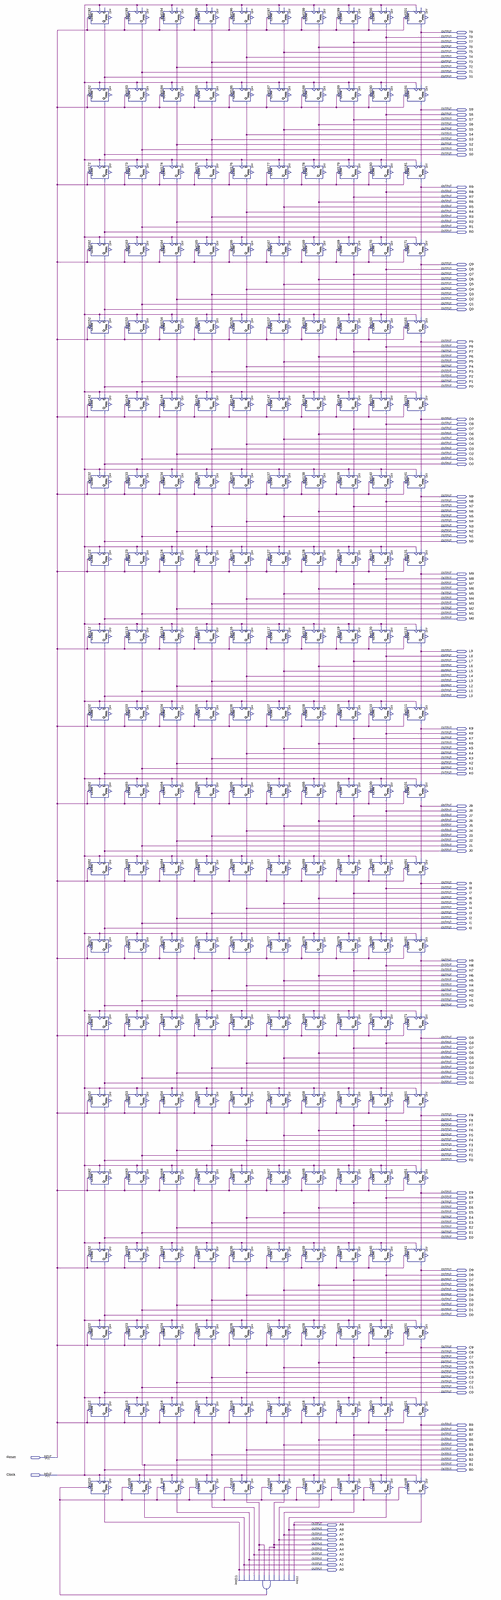
[diagram p0: schematic sheet, whole]
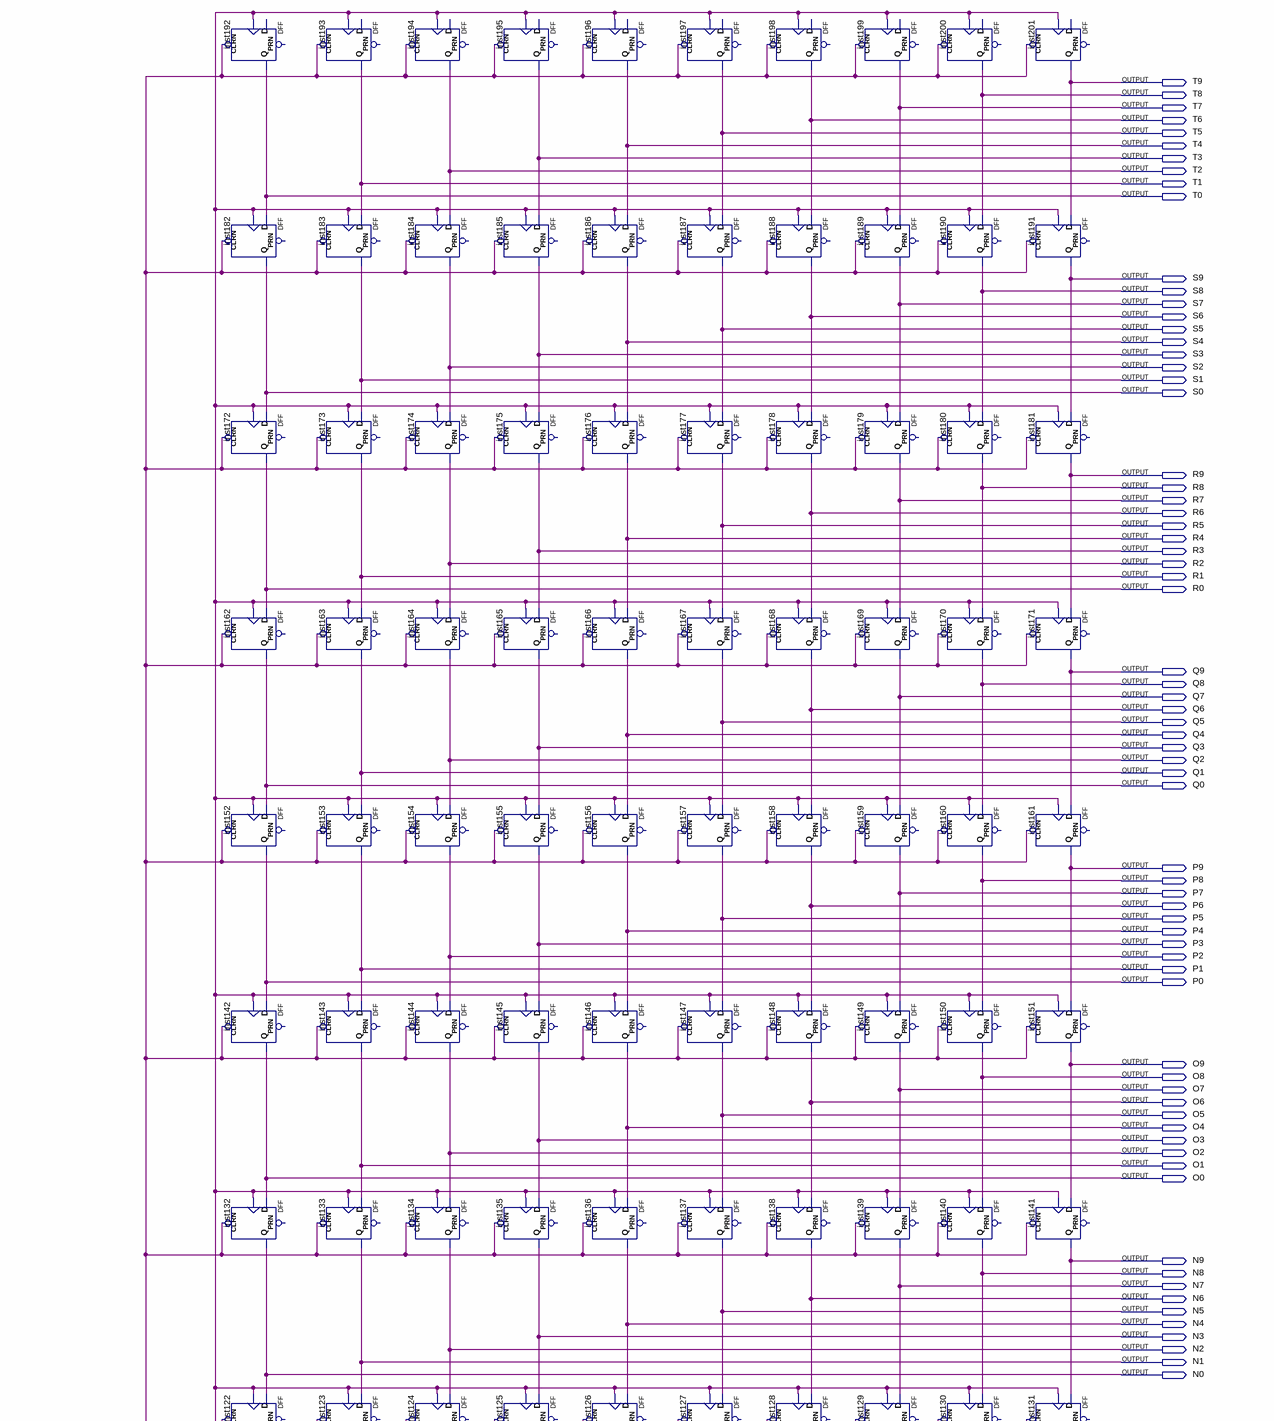
[diagram p1: schematic sheet, upper part]
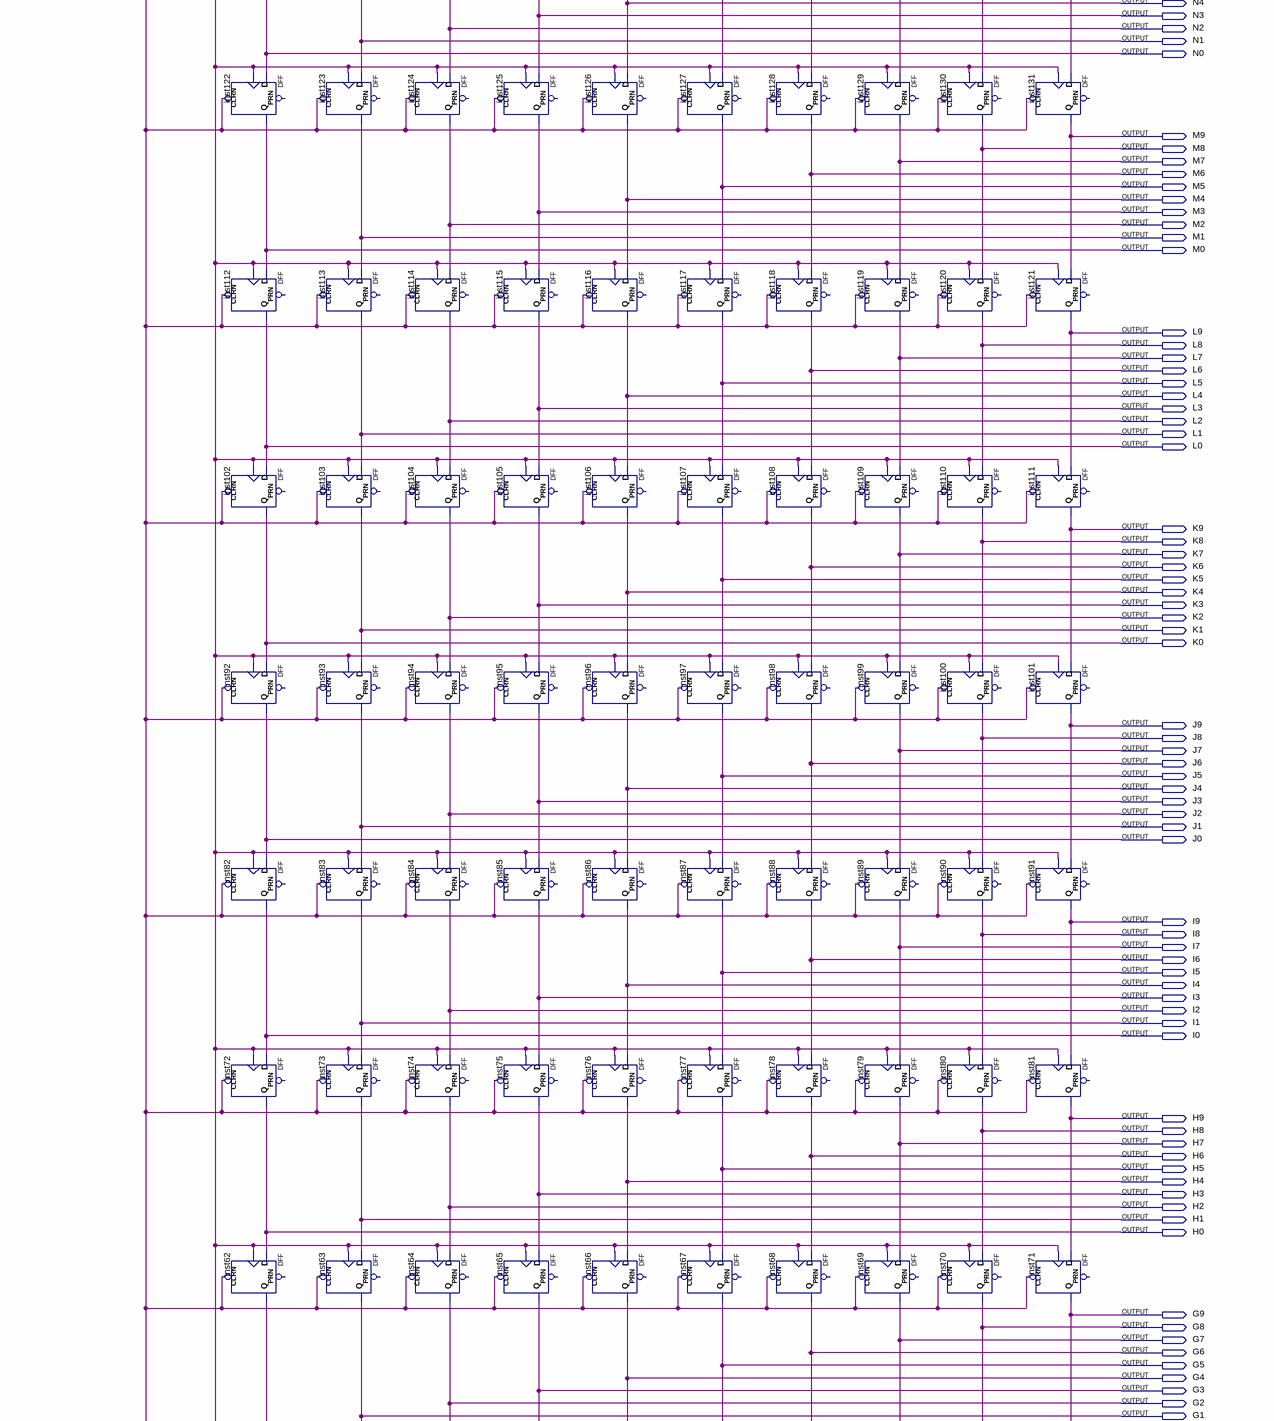
[diagram p2: schematic sheet, middle part]
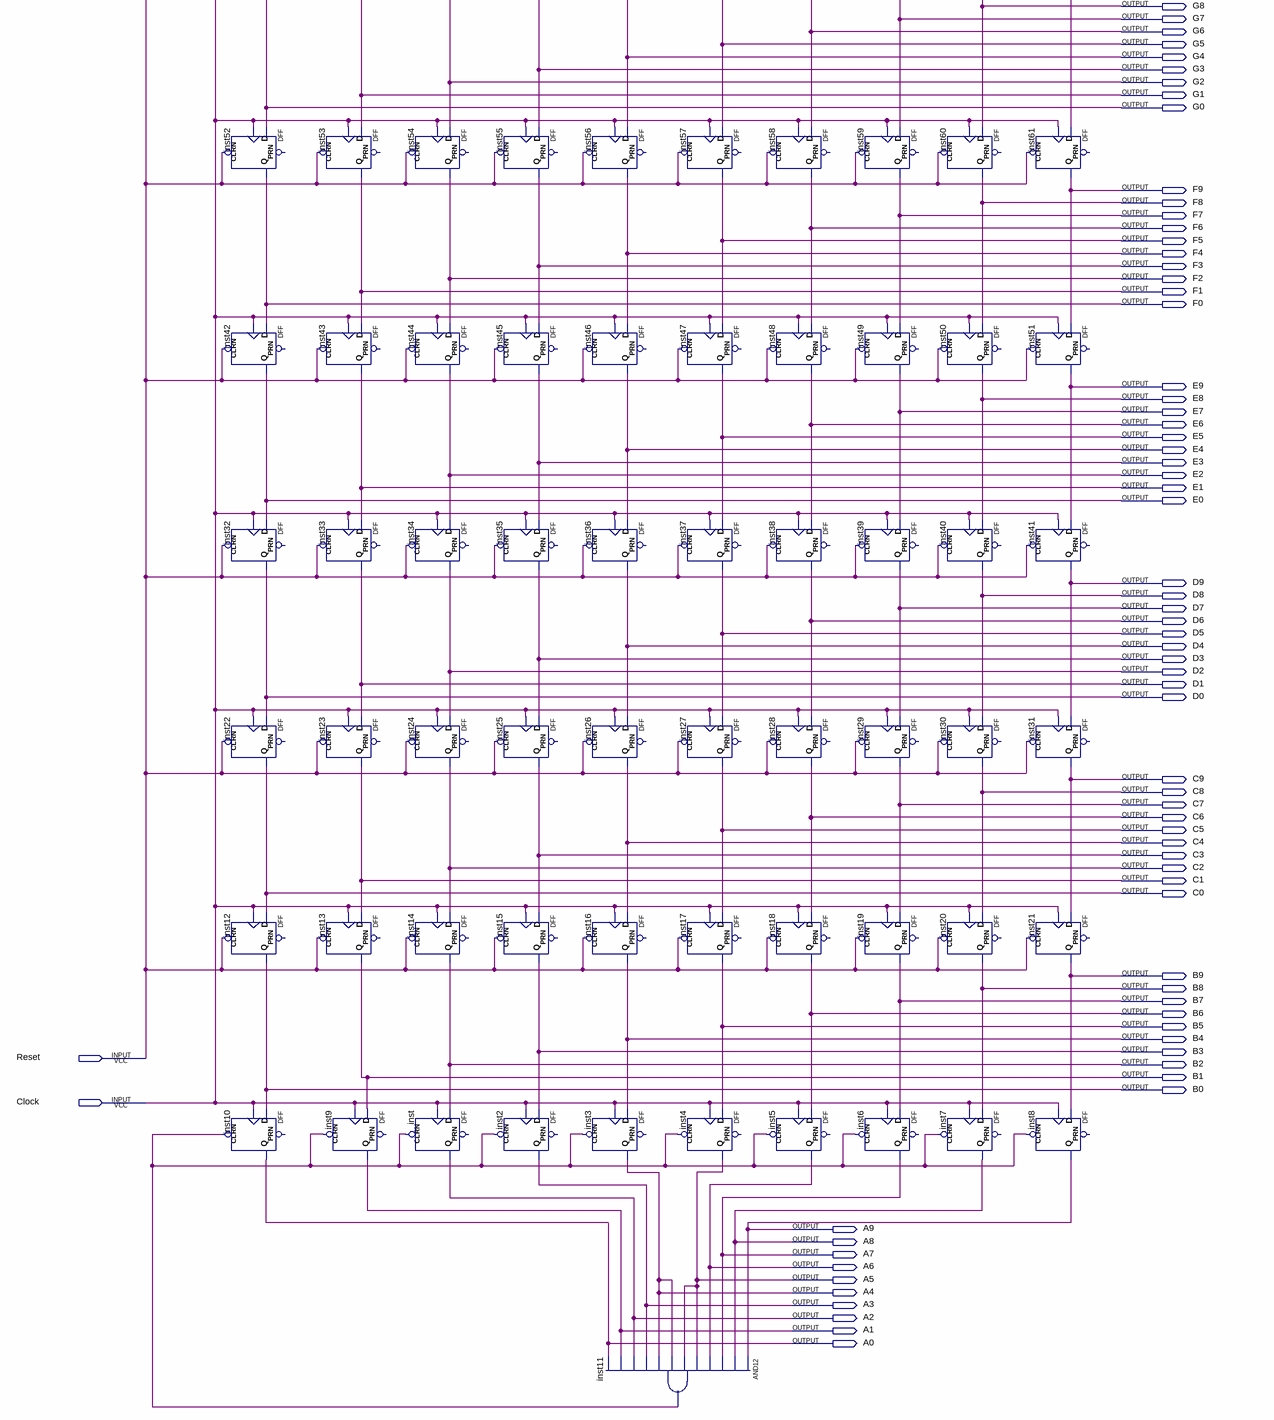
[diagram p3: schematic sheet, lower part]
// Quartus schematic SmallGameBoard.bdf as structural Verilog: 201 symbols, 202 pins
module SmallGameBoard (
  input  Reset,
  input  Clock,
  output T9,
  output T8,
  output T7,
  output T6,
  output T5,
  output T4,
  output T3,
  output T2,
  output T1,
  output T0,
  output S9,
  output S8,
  output S7,
  output S6,
  output S5,
  output S4,
  output S3,
  output S2,
  output S1,
  output S0,
  output R9,
  output R8,
  output R7,
  output R6,
  output R5,
  output R4,
  output R3,
  output R2,
  output R1,
  output R0,
  output Q9,
  output Q8,
  output Q7,
  output Q6,
  output Q5,
  output Q4,
  output Q3,
  output Q2,
  output Q1,
  output Q0,
  output P9,
  output P8,
  output P7,
  output P6,
  output P5,
  output P4,
  output P3,
  output P2,
  output P1,
  output P0,
  output O9,
  output O8,
  output O7,
  output O6,
  output O5,
  output O4,
  output O3,
  output O2,
  output O1,
  output O0,
  output N9,
  output N8,
  output N7,
  output N6,
  output N5,
  output N4,
  output N3,
  output N2,
  output N1,
  output N0,
  output M9,
  output M8,
  output M7,
  output M6,
  output M5,
  output M4,
  output M3,
  output M2,
  output M1,
  output M0,
  output L9,
  output L8,
  output L7,
  output L6,
  output L5,
  output L4,
  output L3,
  output L2,
  output L1,
  output L0,
  output K9,
  output K8,
  output K7,
  output K6,
  output K5,
  output K4,
  output K3,
  output K2,
  output K1,
  output K0,
  output J9,
  output J8,
  output J7,
  output J6,
  output J5,
  output J4,
  output J3,
  output J2,
  output J1,
  output J0,
  output I9,
  output I8,
  output I7,
  output I6,
  output I5,
  output I4,
  output I3,
  output I2,
  output I1,
  output I0,
  output H9,
  output H8,
  output H7,
  output H6,
  output H5,
  output H4,
  output H3,
  output H2,
  output H1,
  output H0,
  output G9,
  output G8,
  output G7,
  output G6,
  output G5,
  output G4,
  output G3,
  output G2,
  output G1,
  output G0,
  output F9,
  output F8,
  output F7,
  output F6,
  output F5,
  output F4,
  output F3,
  output F2,
  output F1,
  output F0,
  output E9,
  output E8,
  output E7,
  output E6,
  output E5,
  output E4,
  output E3,
  output E2,
  output E1,
  output E0,
  output D9,
  output D8,
  output D7,
  output D6,
  output D5,
  output D4,
  output D3,
  output D2,
  output D1,
  output D0,
  output C9,
  output C8,
  output C7,
  output C6,
  output C5,
  output C4,
  output C3,
  output C2,
  output C1,
  output C0,
  output B9,
  output B8,
  output B7,
  output B6,
  output B5,
  output B4,
  output B3,
  output B2,
  output B1,
  output B0,
  output A9,
  output A8,
  output A7,
  output A6,
  output A5,
  output A4,
  output A3,
  output A2,
  output A1,
  output A0
);

  wire inst11_out;

  DFF inst192 (.CLRN(Reset), .CLK(Clock), .Q(T0));  // open: D, PRN
  DFF inst182 (.CLRN(Reset), .CLK(Clock), .D(T0), .Q(S0));  // open: PRN
  DFF inst172 (.CLRN(Reset), .CLK(Clock), .D(S0), .Q(R0));  // open: PRN
  DFF inst162 (.CLRN(Reset), .CLK(Clock), .D(R0), .Q(Q0));  // open: PRN
  DFF inst152 (.CLRN(Reset), .CLK(Clock), .D(Q0), .Q(P0));  // open: PRN
  DFF inst142 (.CLRN(Reset), .CLK(Clock), .D(P0), .Q(O0));  // open: PRN
  DFF inst132 (.CLRN(Reset), .CLK(Clock), .D(O0), .Q(N0));  // open: PRN
  DFF inst122 (.CLRN(Reset), .CLK(Clock), .D(N0), .Q(M0));  // open: PRN
  DFF inst112 (.CLRN(Reset), .CLK(Clock), .D(M0), .Q(L0));  // open: PRN
  DFF inst102 (.CLRN(Reset), .CLK(Clock), .D(L0), .Q(K0));  // open: PRN
  DFF inst92 (.CLRN(Reset), .CLK(Clock), .D(K0), .Q(J0));  // open: PRN
  DFF inst82 (.CLRN(Reset), .CLK(Clock), .D(J0), .Q(I0));  // open: PRN
  DFF inst72 (.CLRN(Reset), .CLK(Clock), .D(I0), .Q(H0));  // open: PRN
  DFF inst62 (.CLRN(Reset), .CLK(Clock), .D(H0), .Q(G0));  // open: PRN
  DFF inst52 (.CLRN(Reset), .CLK(Clock), .D(G0), .Q(F0));  // open: PRN
  DFF inst42 (.CLRN(Reset), .CLK(Clock), .D(F0), .Q(E0));  // open: PRN
  DFF inst32 (.CLRN(Reset), .CLK(Clock), .D(E0), .Q(D0));  // open: PRN
  DFF inst22 (.CLRN(Reset), .CLK(Clock), .D(D0), .Q(C0));  // open: PRN
  DFF inst12 (.CLRN(Reset), .CLK(Clock), .D(C0), .Q(B0));  // open: PRN
  DFF inst10 (.CLRN(inst11_out), .CLK(Clock), .D(B0), .Q(A0));  // open: PRN
  DFF inst193 (.CLRN(Reset), .CLK(Clock), .Q(T1));  // open: D, PRN
  DFF inst183 (.CLRN(Reset), .CLK(Clock), .D(T1), .Q(S1));  // open: PRN
  DFF inst173 (.CLRN(Reset), .CLK(Clock), .D(S1), .Q(R1));  // open: PRN
  DFF inst163 (.CLRN(Reset), .CLK(Clock), .D(R1), .Q(Q1));  // open: PRN
  DFF inst153 (.CLRN(Reset), .CLK(Clock), .D(Q1), .Q(P1));  // open: PRN
  DFF inst143 (.CLRN(Reset), .CLK(Clock), .D(P1), .Q(O1));  // open: PRN
  DFF inst133 (.CLRN(Reset), .CLK(Clock), .D(O1), .Q(N1));  // open: PRN
  DFF inst123 (.CLRN(Reset), .CLK(Clock), .D(N1), .Q(M1));  // open: PRN
  DFF inst113 (.CLRN(Reset), .CLK(Clock), .D(M1), .Q(L1));  // open: PRN
  DFF inst103 (.CLRN(Reset), .CLK(Clock), .D(L1), .Q(K1));  // open: PRN
  DFF inst93 (.CLRN(Reset), .CLK(Clock), .D(K1), .Q(J1));  // open: PRN
  DFF inst83 (.CLRN(Reset), .CLK(Clock), .D(J1), .Q(I1));  // open: PRN
  DFF inst73 (.CLRN(Reset), .CLK(Clock), .D(I1), .Q(H1));  // open: PRN
  DFF inst63 (.CLRN(Reset), .CLK(Clock), .D(H1), .Q(G1));  // open: PRN
  DFF inst53 (.CLRN(Reset), .CLK(Clock), .D(G1), .Q(F1));  // open: PRN
  DFF inst43 (.CLRN(Reset), .CLK(Clock), .D(F1), .Q(E1));  // open: PRN
  DFF inst33 (.CLRN(Reset), .CLK(Clock), .D(E1), .Q(D1));  // open: PRN
  DFF inst23 (.CLRN(Reset), .CLK(Clock), .D(D1), .Q(C1));  // open: PRN
  DFF inst13 (.CLRN(Reset), .CLK(Clock), .D(C1), .Q(B1));  // open: PRN
  DFF inst9 (.CLRN(inst11_out), .CLK(Clock), .D(B1), .Q(A1));  // open: PRN
  DFF inst194 (.CLRN(Reset), .CLK(Clock), .Q(T2));  // open: D, PRN
  DFF inst184 (.CLRN(Reset), .CLK(Clock), .D(T2), .Q(S2));  // open: PRN
  DFF inst174 (.CLRN(Reset), .CLK(Clock), .D(S2), .Q(R2));  // open: PRN
  DFF inst164 (.CLRN(Reset), .CLK(Clock), .D(R2), .Q(Q2));  // open: PRN
  DFF inst154 (.CLRN(Reset), .CLK(Clock), .D(Q2), .Q(P2));  // open: PRN
  DFF inst144 (.CLRN(Reset), .CLK(Clock), .D(P2), .Q(O2));  // open: PRN
  DFF inst134 (.CLRN(Reset), .CLK(Clock), .D(O2), .Q(N2));  // open: PRN
  DFF inst124 (.CLRN(Reset), .CLK(Clock), .D(N2), .Q(M2));  // open: PRN
  DFF inst114 (.CLRN(Reset), .CLK(Clock), .D(M2), .Q(L2));  // open: PRN
  DFF inst104 (.CLRN(Reset), .CLK(Clock), .D(L2), .Q(K2));  // open: PRN
  DFF inst94 (.CLRN(Reset), .CLK(Clock), .D(K2), .Q(J2));  // open: PRN
  DFF inst84 (.CLRN(Reset), .CLK(Clock), .D(J2), .Q(I2));  // open: PRN
  DFF inst74 (.CLRN(Reset), .CLK(Clock), .D(I2), .Q(H2));  // open: PRN
  DFF inst64 (.CLRN(Reset), .CLK(Clock), .D(H2), .Q(G2));  // open: PRN
  DFF inst54 (.CLRN(Reset), .CLK(Clock), .D(G2), .Q(F2));  // open: PRN
  DFF inst44 (.CLRN(Reset), .CLK(Clock), .D(F2), .Q(E2));  // open: PRN
  DFF inst34 (.CLRN(Reset), .CLK(Clock), .D(E2), .Q(D2));  // open: PRN
  DFF inst24 (.CLRN(Reset), .CLK(Clock), .D(D2), .Q(C2));  // open: PRN
  DFF inst14 (.CLRN(Reset), .CLK(Clock), .D(C2), .Q(B2));  // open: PRN
  DFF inst (.CLRN(inst11_out), .CLK(Clock), .D(B2), .Q(A2));  // open: PRN
  DFF inst195 (.CLRN(Reset), .CLK(Clock), .Q(T3));  // open: D, PRN
  DFF inst185 (.CLRN(Reset), .CLK(Clock), .D(T3), .Q(S3));  // open: PRN
  DFF inst175 (.CLRN(Reset), .CLK(Clock), .D(S3), .Q(R3));  // open: PRN
  DFF inst165 (.CLRN(Reset), .CLK(Clock), .D(R3), .Q(Q3));  // open: PRN
  DFF inst155 (.CLRN(Reset), .CLK(Clock), .D(Q3), .Q(P3));  // open: PRN
  DFF inst145 (.CLRN(Reset), .CLK(Clock), .D(P3), .Q(O3));  // open: PRN
  DFF inst135 (.CLRN(Reset), .CLK(Clock), .D(O3), .Q(N3));  // open: PRN
  DFF inst125 (.CLRN(Reset), .CLK(Clock), .D(N3), .Q(M3));  // open: PRN
  DFF inst115 (.CLRN(Reset), .CLK(Clock), .D(M3), .Q(L3));  // open: PRN
  DFF inst105 (.CLRN(Reset), .CLK(Clock), .D(L3), .Q(K3));  // open: PRN
  DFF inst95 (.CLRN(Reset), .CLK(Clock), .D(K3), .Q(J3));  // open: PRN
  DFF inst85 (.CLRN(Reset), .CLK(Clock), .D(J3), .Q(I3));  // open: PRN
  DFF inst75 (.CLRN(Reset), .CLK(Clock), .D(I3), .Q(H3));  // open: PRN
  DFF inst65 (.CLRN(Reset), .CLK(Clock), .D(H3), .Q(G3));  // open: PRN
  DFF inst55 (.CLRN(Reset), .CLK(Clock), .D(G3), .Q(F3));  // open: PRN
  DFF inst45 (.CLRN(Reset), .CLK(Clock), .D(F3), .Q(E3));  // open: PRN
  DFF inst35 (.CLRN(Reset), .CLK(Clock), .D(E3), .Q(D3));  // open: PRN
  DFF inst25 (.CLRN(Reset), .CLK(Clock), .D(D3), .Q(C3));  // open: PRN
  DFF inst15 (.CLRN(Reset), .CLK(Clock), .D(C3), .Q(B3));  // open: PRN
  DFF inst2 (.CLRN(inst11_out), .CLK(Clock), .D(B3), .Q(A3));  // open: PRN
  DFF inst196 (.CLRN(Reset), .CLK(Clock), .Q(T4));  // open: D, PRN
  DFF inst186 (.CLRN(Reset), .CLK(Clock), .D(T4), .Q(S4));  // open: PRN
  DFF inst176 (.CLRN(Reset), .CLK(Clock), .D(S4), .Q(R4));  // open: PRN
  DFF inst166 (.CLRN(Reset), .CLK(Clock), .D(R4), .Q(Q4));  // open: PRN
  DFF inst156 (.CLRN(Reset), .CLK(Clock), .D(Q4), .Q(P4));  // open: PRN
  DFF inst146 (.CLRN(Reset), .CLK(Clock), .D(P4), .Q(O4));  // open: PRN
  DFF inst136 (.CLRN(Reset), .CLK(Clock), .D(O4), .Q(N4));  // open: PRN
  DFF inst126 (.CLRN(Reset), .CLK(Clock), .D(N4), .Q(M4));  // open: PRN
  DFF inst116 (.CLRN(Reset), .CLK(Clock), .D(M4), .Q(L4));  // open: PRN
  DFF inst106 (.CLRN(Reset), .CLK(Clock), .D(L4), .Q(K4));  // open: PRN
  DFF inst96 (.CLRN(Reset), .CLK(Clock), .D(K4), .Q(J4));  // open: PRN
  DFF inst86 (.CLRN(Reset), .CLK(Clock), .D(J4), .Q(I4));  // open: PRN
  DFF inst76 (.CLRN(Reset), .CLK(Clock), .D(I4), .Q(H4));  // open: PRN
  DFF inst66 (.CLRN(Reset), .CLK(Clock), .D(H4), .Q(G4));  // open: PRN
  DFF inst56 (.CLRN(Reset), .CLK(Clock), .D(G4), .Q(F4));  // open: PRN
  DFF inst46 (.CLRN(Reset), .CLK(Clock), .D(F4), .Q(E4));  // open: PRN
  DFF inst36 (.CLRN(Reset), .CLK(Clock), .D(E4), .Q(D4));  // open: PRN
  DFF inst26 (.CLRN(Reset), .CLK(Clock), .D(D4), .Q(C4));  // open: PRN
  DFF inst16 (.CLRN(Reset), .CLK(Clock), .D(C4), .Q(B4));  // open: PRN
  DFF inst3 (.CLRN(inst11_out), .CLK(Clock), .D(B4), .Q(A4));  // open: PRN
  and inst11 (inst11_out, A9, A8, A7, A6, A5, A5, A4, A4, A3, A2, A1, A0);
  DFF inst197 (.CLRN(Reset), .CLK(Clock), .Q(T5));  // open: D, PRN
  DFF inst187 (.CLRN(Reset), .CLK(Clock), .D(T5), .Q(S5));  // open: PRN
  DFF inst177 (.CLRN(Reset), .CLK(Clock), .D(S5), .Q(R5));  // open: PRN
  DFF inst167 (.CLRN(Reset), .CLK(Clock), .D(R5), .Q(Q5));  // open: PRN
  DFF inst157 (.CLRN(Reset), .CLK(Clock), .D(Q5), .Q(P5));  // open: PRN
  DFF inst147 (.CLRN(Reset), .CLK(Clock), .D(P5), .Q(O5));  // open: PRN
  DFF inst137 (.CLRN(Reset), .CLK(Clock), .D(O5), .Q(N5));  // open: PRN
  DFF inst127 (.CLRN(Reset), .CLK(Clock), .D(N5), .Q(M5));  // open: PRN
  DFF inst117 (.CLRN(Reset), .CLK(Clock), .D(M5), .Q(L5));  // open: PRN
  DFF inst107 (.CLRN(Reset), .CLK(Clock), .D(L5), .Q(K5));  // open: PRN
  DFF inst97 (.CLRN(Reset), .CLK(Clock), .D(K5), .Q(J5));  // open: PRN
  DFF inst87 (.CLRN(Reset), .CLK(Clock), .D(J5), .Q(I5));  // open: PRN
  DFF inst77 (.CLRN(Reset), .CLK(Clock), .D(I5), .Q(H5));  // open: PRN
  DFF inst67 (.CLRN(Reset), .CLK(Clock), .D(H5), .Q(G5));  // open: PRN
  DFF inst57 (.CLRN(Reset), .CLK(Clock), .D(G5), .Q(F5));  // open: PRN
  DFF inst47 (.CLRN(Reset), .CLK(Clock), .D(F5), .Q(E5));  // open: PRN
  DFF inst37 (.CLRN(Reset), .CLK(Clock), .D(E5), .Q(D5));  // open: PRN
  DFF inst27 (.CLRN(Reset), .CLK(Clock), .D(D5), .Q(C5));  // open: PRN
  DFF inst17 (.CLRN(Reset), .CLK(Clock), .D(C5), .Q(B5));  // open: PRN
  DFF inst4 (.CLRN(inst11_out), .CLK(Clock), .D(B5), .Q(A5));  // open: PRN
  DFF inst198 (.CLRN(Reset), .CLK(Clock), .Q(T6));  // open: D, PRN
  DFF inst188 (.CLRN(Reset), .CLK(Clock), .D(T6), .Q(S6));  // open: PRN
  DFF inst178 (.CLRN(Reset), .CLK(Clock), .D(S6), .Q(R6));  // open: PRN
  DFF inst168 (.CLRN(Reset), .CLK(Clock), .D(R6), .Q(Q6));  // open: PRN
  DFF inst158 (.CLRN(Reset), .CLK(Clock), .D(Q6), .Q(P6));  // open: PRN
  DFF inst148 (.CLRN(Reset), .CLK(Clock), .D(P6), .Q(O6));  // open: PRN
  DFF inst138 (.CLRN(Reset), .CLK(Clock), .D(O6), .Q(N6));  // open: PRN
  DFF inst128 (.CLRN(Reset), .CLK(Clock), .D(N6), .Q(M6));  // open: PRN
  DFF inst118 (.CLRN(Reset), .CLK(Clock), .D(M6), .Q(L6));  // open: PRN
  DFF inst108 (.CLRN(Reset), .CLK(Clock), .D(L6), .Q(K6));  // open: PRN
  DFF inst98 (.CLRN(Reset), .CLK(Clock), .D(K6), .Q(J6));  // open: PRN
  DFF inst88 (.CLRN(Reset), .CLK(Clock), .D(J6), .Q(I6));  // open: PRN
  DFF inst78 (.CLRN(Reset), .CLK(Clock), .D(I6), .Q(H6));  // open: PRN
  DFF inst68 (.CLRN(Reset), .CLK(Clock), .D(H6), .Q(G6));  // open: PRN
  DFF inst58 (.CLRN(Reset), .CLK(Clock), .D(G6), .Q(F6));  // open: PRN
  DFF inst48 (.CLRN(Reset), .CLK(Clock), .D(F6), .Q(E6));  // open: PRN
  DFF inst38 (.CLRN(Reset), .CLK(Clock), .D(E6), .Q(D6));  // open: PRN
  DFF inst28 (.CLRN(Reset), .CLK(Clock), .D(D6), .Q(C6));  // open: PRN
  DFF inst18 (.CLRN(Reset), .CLK(Clock), .D(C6), .Q(B6));  // open: PRN
  DFF inst5 (.CLRN(inst11_out), .CLK(Clock), .D(B6), .Q(A6));  // open: PRN
  DFF inst199 (.CLRN(Reset), .CLK(Clock), .Q(T7));  // open: D, PRN
  DFF inst189 (.CLRN(Reset), .CLK(Clock), .D(T7), .Q(S7));  // open: PRN
  DFF inst179 (.CLRN(Reset), .CLK(Clock), .D(S7), .Q(R7));  // open: PRN
  DFF inst169 (.CLRN(Reset), .CLK(Clock), .D(R7), .Q(Q7));  // open: PRN
  DFF inst159 (.CLRN(Reset), .CLK(Clock), .D(Q7), .Q(P7));  // open: PRN
  DFF inst149 (.CLRN(Reset), .CLK(Clock), .D(P7), .Q(O7));  // open: PRN
  DFF inst139 (.CLRN(Reset), .CLK(Clock), .D(O7), .Q(N7));  // open: PRN
  DFF inst129 (.CLRN(Reset), .CLK(Clock), .D(N7), .Q(M7));  // open: PRN
  DFF inst119 (.CLRN(Reset), .CLK(Clock), .D(M7), .Q(L7));  // open: PRN
  DFF inst109 (.CLRN(Reset), .CLK(Clock), .D(L7), .Q(K7));  // open: PRN
  DFF inst99 (.CLRN(Reset), .CLK(Clock), .D(K7), .Q(J7));  // open: PRN
  DFF inst89 (.CLRN(Reset), .CLK(Clock), .D(J7), .Q(I7));  // open: PRN
  DFF inst79 (.CLRN(Reset), .CLK(Clock), .D(I7), .Q(H7));  // open: PRN
  DFF inst69 (.CLRN(Reset), .CLK(Clock), .D(H7), .Q(G7));  // open: PRN
  DFF inst59 (.CLRN(Reset), .CLK(Clock), .D(G7), .Q(F7));  // open: PRN
  DFF inst49 (.CLRN(Reset), .CLK(Clock), .D(F7), .Q(E7));  // open: PRN
  DFF inst39 (.CLRN(Reset), .CLK(Clock), .D(E7), .Q(D7));  // open: PRN
  DFF inst29 (.CLRN(Reset), .CLK(Clock), .D(D7), .Q(C7));  // open: PRN
  DFF inst19 (.CLRN(Reset), .CLK(Clock), .D(C7), .Q(B7));  // open: PRN
  DFF inst6 (.CLRN(inst11_out), .CLK(Clock), .D(B7), .Q(A7));  // open: PRN
  DFF inst200 (.CLRN(Reset), .CLK(Clock), .Q(T8));  // open: D, PRN
  DFF inst190 (.CLRN(Reset), .CLK(Clock), .D(T8), .Q(S8));  // open: PRN
  DFF inst180 (.CLRN(Reset), .CLK(Clock), .D(S8), .Q(R8));  // open: PRN
  DFF inst170 (.CLRN(Reset), .CLK(Clock), .D(R8), .Q(Q8));  // open: PRN
  DFF inst160 (.CLRN(Reset), .CLK(Clock), .D(Q8), .Q(P8));  // open: PRN
  DFF inst150 (.CLRN(Reset), .CLK(Clock), .D(P8), .Q(O8));  // open: PRN
  DFF inst140 (.CLRN(Reset), .CLK(Clock), .D(O8), .Q(N8));  // open: PRN
  DFF inst130 (.CLRN(Reset), .CLK(Clock), .D(N8), .Q(M8));  // open: PRN
  DFF inst120 (.CLRN(Reset), .CLK(Clock), .D(M8), .Q(L8));  // open: PRN
  DFF inst110 (.CLRN(Reset), .CLK(Clock), .D(L8), .Q(K8));  // open: PRN
  DFF inst100 (.CLRN(Reset), .CLK(Clock), .D(K8), .Q(J8));  // open: PRN
  DFF inst90 (.CLRN(Reset), .CLK(Clock), .D(J8), .Q(I8));  // open: PRN
  DFF inst80 (.CLRN(Reset), .CLK(Clock), .D(I8), .Q(H8));  // open: PRN
  DFF inst70 (.CLRN(Reset), .CLK(Clock), .D(H8), .Q(G8));  // open: PRN
  DFF inst60 (.CLRN(Reset), .CLK(Clock), .D(G8), .Q(F8));  // open: PRN
  DFF inst50 (.CLRN(Reset), .CLK(Clock), .D(F8), .Q(E8));  // open: PRN
  DFF inst40 (.CLRN(Reset), .CLK(Clock), .D(E8), .Q(D8));  // open: PRN
  DFF inst30 (.CLRN(Reset), .CLK(Clock), .D(D8), .Q(C8));  // open: PRN
  DFF inst20 (.CLRN(Reset), .CLK(Clock), .D(C8), .Q(B8));  // open: PRN
  DFF inst7 (.CLRN(inst11_out), .CLK(Clock), .D(B8), .Q(A8));  // open: PRN
  DFF inst201 (.CLRN(Reset), .CLK(Clock), .Q(T9));  // open: D, PRN
  DFF inst191 (.CLRN(Reset), .CLK(Clock), .D(T9), .Q(S9));  // open: PRN
  DFF inst181 (.CLRN(Reset), .CLK(Clock), .D(S9), .Q(R9));  // open: PRN
  DFF inst171 (.CLRN(Reset), .CLK(Clock), .D(R9), .Q(Q9));  // open: PRN
  DFF inst161 (.CLRN(Reset), .CLK(Clock), .D(Q9), .Q(P9));  // open: PRN
  DFF inst151 (.CLRN(Reset), .CLK(Clock), .D(P9), .Q(O9));  // open: PRN
  DFF inst141 (.CLRN(Reset), .CLK(Clock), .D(O9), .Q(N9));  // open: PRN
  DFF inst131 (.CLRN(Reset), .CLK(Clock), .D(N9), .Q(M9));  // open: PRN
  DFF inst121 (.CLRN(Reset), .CLK(Clock), .D(M9), .Q(L9));  // open: PRN
  DFF inst111 (.CLRN(Reset), .CLK(Clock), .D(L9), .Q(K9));  // open: PRN
  DFF inst101 (.CLRN(Reset), .CLK(Clock), .D(K9), .Q(J9));  // open: PRN
  DFF inst91 (.CLRN(Reset), .CLK(Clock), .D(J9), .Q(I9));  // open: PRN
  DFF inst81 (.CLRN(Reset), .CLK(Clock), .D(I9), .Q(H9));  // open: PRN
  DFF inst71 (.CLRN(Reset), .CLK(Clock), .D(H9), .Q(G9));  // open: PRN
  DFF inst61 (.CLRN(Reset), .CLK(Clock), .D(G9), .Q(F9));  // open: PRN
  DFF inst51 (.CLRN(Reset), .CLK(Clock), .D(F9), .Q(E9));  // open: PRN
  DFF inst41 (.CLRN(Reset), .CLK(Clock), .D(E9), .Q(D9));  // open: PRN
  DFF inst31 (.CLRN(Reset), .CLK(Clock), .D(D9), .Q(C9));  // open: PRN
  DFF inst21 (.CLRN(Reset), .CLK(Clock), .D(C9), .Q(B9));  // open: PRN
  DFF inst8 (.CLRN(inst11_out), .CLK(Clock), .D(B9), .Q(A9));  // open: PRN
endmodule
